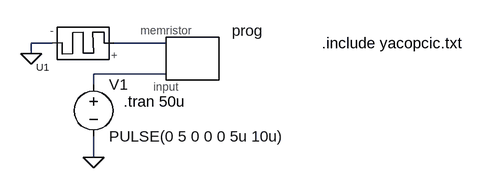
[diagram p0: schematic Draft6.asc]
Draft6.asc, the LTspice schematic file:
Version 4
SHEET 1 880 680
WIRE -32 80 -64 80
WIRE 144 80 64 80
WIRE -64 96 -64 80
WIRE 144 128 32 128
WIRE 32 144 32 128
WIRE 32 256 32 224
FLAG 32 256 0
FLAG -64 96 0
SYMBOL programmer_block 192 128 R0
SYMATTR InstName prog
SYMBOL memristormodel -16 80 R180
SYMATTR InstName U1
SYMATTR Value MEM_YAKOPCIC
SYMBOL voltage 32 128 R0
WINDOW 123 0 0 Left 2
WINDOW 39 0 0 Left 2
SYMATTR InstName V1
SYMATTR Value PULSE(0 5 0 0 0 5u 10u)
TEXT 78 170 Left 2 !.tran 50u
TEXT 384 80 Left 2 !.include yacopcic.txt

The netlist it stands for:
* Draft6.asc
Xprog N001 N002 programmer_block  ; pins memristor input
XU1 N001 0 M MEM_YAKOPCIC  ; pins + -
V1 N002 0 PULSE(0 5 0 0 0 5u 10u)
.tran 50u
.include yacopcic.txt
.backanno
.end